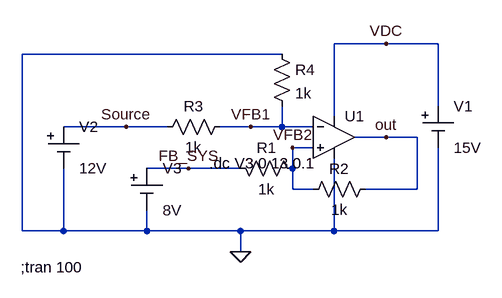
[diagram p0: schematic Op_AMP_Substractor.asc]
Op_AMP_Substractor.asc, the LTspice schematic file:
Version 4
SHEET 1 880 680
WIRE 288 48 208 48
WIRE 368 48 288 48
WIRE 128 64 -272 64
WIRE 368 144 368 48
WIRE 208 160 208 48
WIRE -112 176 -208 176
WIRE -48 176 -112 176
WIRE 80 176 32 176
WIRE 128 176 128 144
WIRE 128 176 80 176
WIRE 176 176 128 176
WIRE 288 192 240 192
WIRE 336 192 288 192
WIRE 176 208 144 208
WIRE -16 240 -80 240
WIRE 64 240 -16 240
WIRE 144 240 144 208
WIRE 144 272 144 240
WIRE 176 272 144 272
WIRE 336 272 336 192
WIRE 336 272 256 272
WIRE -272 336 -272 64
WIRE -208 336 -208 240
WIRE -208 336 -272 336
WIRE -80 336 -80 304
WIRE -80 336 -208 336
WIRE 64 336 -80 336
WIRE 208 336 208 224
WIRE 208 336 64 336
WIRE 368 336 368 208
WIRE 368 336 208 336
WIRE 64 368 64 336
FLAG 64 368 0
FLAG 288 48 VDC
FLAG -112 176 Source
FLAG -16 240 FB_SYS
FLAG 288 192 out
FLAG 80 176 VFB1
FLAG 144 208 VFB2
SYMBOL Misc\\cell 368 144 R0
SYMATTR InstName V1
SYMATTR Value 15V
SYMBOL OpAmps\\UniversalOpAmp 208 192 R0
SYMATTR InstName U1
SYMBOL res 160 256 M270
WINDOW 0 32 56 VTop 2
WINDOW 3 0 56 VBottom 2
SYMATTR InstName R1
SYMATTR Value 1k
SYMBOL res 272 256 R90
WINDOW 0 0 56 VBottom 2
WINDOW 3 32 56 VTop 2
SYMATTR InstName R2
SYMATTR Value 1k
SYMBOL res 48 160 R90
WINDOW 0 0 56 VBottom 2
WINDOW 3 32 56 VTop 2
SYMATTR InstName R3
SYMATTR Value 1k
SYMBOL res 112 48 R0
SYMATTR InstName R4
SYMATTR Value 1k
SYMBOL Misc\\cell -208 176 R0
SYMATTR InstName V2
SYMATTR Value 12V
SYMBOL Misc\\cell -80 240 R0
SYMATTR InstName V3
SYMATTR Value 8V
TEXT -274 392 Left 2 !;tran 100
TEXT 16 232 Left 2 !.dc V3 0 13 0.1

The netlist it stands for:
* Op_AMP_Substractor.asc
V1 VDC 0 15V
XU1 VFB2 VFB1 VDC 0 out level1 Avol=1Meg GBW=10Meg Vos=0 En=0 Enk=0 In=0 Ink=0 Rin=500Meg  ; pins In+ In- V+ V- OUT
R1 VFB2 FB_SYS 1k
R2 out VFB2 1k
R3 VFB1 Source 1k
R4 0 VFB1 1k
V2 Source 0 12V
V3 FB_SYS 0 8V
;tran 100
.dc V3 0 13 0.1
.lib UniversalOpAmp1.lib
.backanno
.end